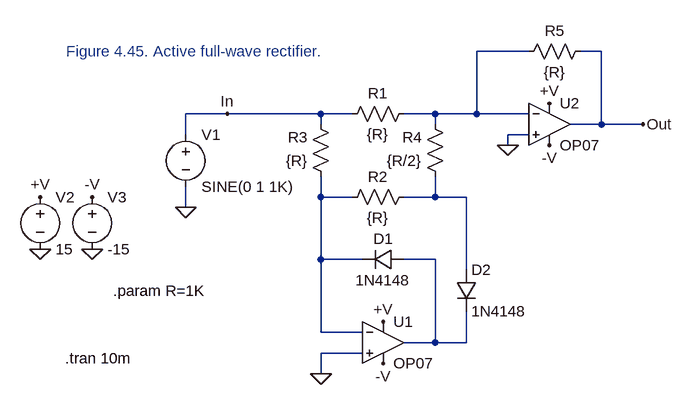
[diagram p0: schematic 04_45 - Active full-wave rectifier.asc]
04_45 - Active full-wave rectifier.asc, the LTspice schematic file:
Version 4
SHEET 1 880 680
WIRE 416 0 336 0
WIRE 528 0 496 0
WIRE -48 96 -112 96
WIRE 96 96 -48 96
WIRE 144 96 96 96
WIRE 272 96 224 96
WIRE 336 96 336 0
WIRE 336 96 272 96
WIRE 416 96 336 96
WIRE 96 112 96 96
WIRE 272 112 272 96
WIRE 528 112 528 0
WIRE 528 112 480 112
WIRE 592 112 528 112
WIRE -112 128 -112 96
WIRE 416 128 384 128
WIRE 384 144 384 128
WIRE 96 224 96 192
WIRE 144 224 96 224
WIRE 272 224 272 192
WIRE 272 224 224 224
WIRE 320 224 272 224
WIRE -112 240 -112 208
WIRE 96 320 96 224
WIRE 160 320 96 320
WIRE 272 320 224 320
WIRE 320 336 320 224
WIRE 96 432 96 320
WIRE 160 432 96 432
WIRE 272 448 272 320
WIRE 272 448 224 448
WIRE 320 448 320 400
WIRE 320 448 272 448
WIRE 160 464 96 464
WIRE 96 496 96 464
FLAG 96 496 0
FLAG -112 240 0
FLAG 384 144 0
FLAG 592 112 Out
FLAG -48 96 In
FLAG -336 304 0
FLAG -256 304 0
FLAG -336 224 +V
FLAG -256 224 -V
FLAG 192 480 -V
FLAG 192 416 +V
FLAG 448 80 +V
FLAG 448 144 -V
SYMBOL res 128 112 R270
WINDOW 0 32 56 VTop 2
WINDOW 3 0 56 VBottom 2
SYMATTR InstName R1
SYMATTR Value {R}
SYMBOL res 240 208 R90
WINDOW 0 0 56 VBottom 2
WINDOW 3 32 56 VTop 2
SYMATTR InstName R2
SYMATTR Value {R}
SYMBOL res 112 208 R180
WINDOW 0 36 76 Left 2
WINDOW 3 36 40 Left 2
SYMATTR InstName R3
SYMATTR Value {R}
SYMBOL res 288 208 R180
WINDOW 0 36 76 Left 2
WINDOW 3 36 40 Left 2
SYMATTR InstName R4
SYMATTR Value {R/2}
SYMBOL diode 224 304 R90
WINDOW 0 0 32 VBottom 2
WINDOW 3 32 32 VTop 2
SYMATTR InstName D1
SYMATTR Value 1N4148
SYMBOL Opamps\\OP07 192 384 R0
SYMATTR InstName U1
SYMBOL diode 304 336 R0
SYMATTR InstName D2
SYMATTR Value 1N4148
SYMBOL voltage -112 112 R0
WINDOW 123 0 0 Left 2
WINDOW 39 0 0 Left 2
SYMATTR InstName V1
SYMATTR Value SINE(0 1 1K)
SYMBOL Opamps\\OP07 448 48 R0
SYMATTR InstName U2
SYMBOL res 400 16 R270
WINDOW 0 32 56 VTop 2
WINDOW 3 0 56 VBottom 2
SYMATTR InstName R5
SYMATTR Value {R}
SYMBOL voltage -336 208 R0
WINDOW 123 0 0 Left 2
WINDOW 39 0 0 Left 2
SYMATTR InstName V2
SYMATTR Value 15
SYMBOL voltage -256 208 R0
WINDOW 123 0 0 Left 2
WINDOW 39 0 0 Left 2
SYMATTR InstName V3
SYMATTR Value -15
TEXT -224 368 Left 2 !.param R=1K
TEXT -296 0 Left 2 ;Figure 4.45. Active full-wave rectifier.
TEXT -298 472 Left 2 !.tran 10m

The netlist it stands for:
* 04_45 - Active full-wave rectifier.asc
R1 In N001 {R}
R2 N003 N002 {R}
R3 N002 In {R}
R4 N003 N001 {R/2}
D1 N004 N002 1N4148
XU1 0 N002 +V -V N004 LT1001  ; OP07, pins In+ In- V+ V- OUT
D2 N003 N004 1N4148
V1 In 0 SINE(0 1 1K)
XU2 0 N001 +V -V Out LT1001  ; OP07, pins In+ In- V+ V- OUT
R5 N001 Out {R}
V2 +V 0 15
V3 -V 0 -15
.model D D
.lib standard.dio
.param R=1K
* Figure 4.45. Active full-wave rectifier.
.tran 10m
.lib LTC.lib
.backanno
.end